# Altium schematic sheet 00 - Main.SchDoc
size A4; SheetNumber: 1; SheetTotal: 3
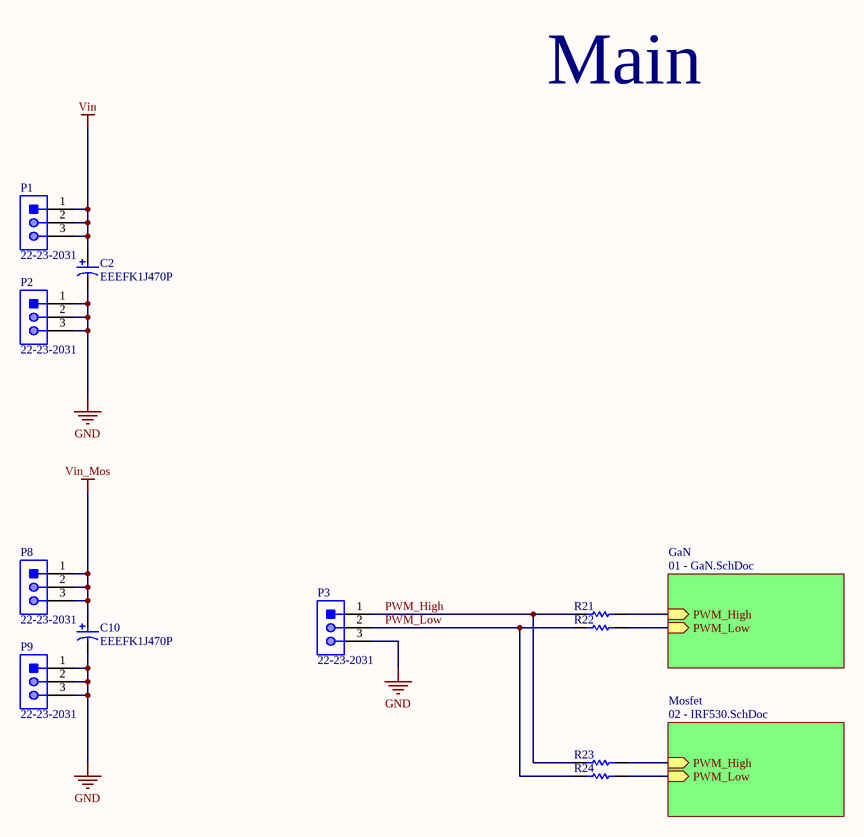
[diagram p0: 00 - Main.SchDoc]

## Parts
C2  EEEFK1J470P  [PNSC-FK-V-F_V]
C10  EEEFK1J470P  [PNSC-FK-V-F_V]
P1  22-23-2031  [MOLX-22-23-2031_V]
P2  22-23-2031  [MOLX-22-23-2031_V]
P3  22-23-2031  [MOLX-22-23-2031_V]
P8  22-23-2031  [MOLX-22-23-2031_V]
P9  22-23-2031  [MOLX-22-23-2031_V]
R21  CRCW02010000Z0ED  [RESC0603X28X15NL5T05]  (value not drawn)
R22  CRCW02010000Z0ED  [RESC0603X28X15NL5T05]  (value not drawn)
R23  CRCW02010000Z0ED  [RESC0603X28X15NL5T05]  (value not drawn)
R24  CRCW02010000Z0ED  [RESC0603X28X15NL5T05]  (value not drawn)

## Sub-sheets
GaN = 01 - GaN.SchDoc: PWM_High (in), PWM_Low (in)
Mosfet = 02 - IRF530.SchDoc: PWM_High (in), PWM_Low (in)

## Nets
GND: C2.2 C10.2 P2.1 P2.2 P2.3 P3.3 P9.1 P9.2 P9.3
Vin: C2.1 P1.1 P1.2 P1.3
Vin_Mos: C10.1 P8.1 P8.2 P8.3
PWM_High: P3.1 R21.2 R23.2
PWM_Low: P3.2 R22.2 R24.2
NetR21_1: R21.1 ; sheet GaN/PWM_High
NetR22_1: R22.1 ; sheet GaN/PWM_Low
NetR23_1: R23.1 ; sheet Mosfet/PWM_High
NetR24_1: R24.1 ; sheet Mosfet/PWM_Low

## Notes on the sheet
- Main

## Library data of the parts
C2 C10 = CMP-2000-06210-1: Aluminum Electrolytic Capacitor, 47 uF, +/- 20%, 63 V, 2-Pin SMD (Size Code F), -55 to 105 degC, RoHS, Tape and Reel; Manufacturer: Panasonic; External Length / Height: 10.2mm; Power Factor: 0.08; AE Capacitor Case: RadialCan-SMD; Operating Lifetime: 2000h; Voltage Rating: 63V; SVHC: NoSVHC(16-Dec-2013); Life Time @ Temperature: 2000hours@105°C; Ripple Current AC: 250mA; Ripple Current Frequency: 100kHz; Power Factor Frequency: 120Hz; Capacitance: 47µF; Impedance: 0.65ohm; Product Range: PANASONIC-FKSeries; Ripple Current Temperature: 105°C; Package Description: 2-Pin Electrolytic Aluminum Capacitor, Body 8.3 x 8.3 mm; Package Reference: FK-V-F; Mounting Technology: SurfaceMount; Operating Temperature Min: -55°C; Capacitor Case Style: SMD; Datasheet URL: http://industrial.panasonic.com/cdbs/www-data/pdf/RDE0000/ABA0000C1181.pdf; Package / Case: F; Capacitance Tolerance ±: ±20%; Packaging: CutTape; Operating Temperature Max: 105°C; Voltage Rating V DC: 63V; Datasheet Version: 03/2016; Tolerance +: 20%; Diameter: 8mm; Tolerance -: 20%; Capacitor Terminals: SMD; Manufacturer URL: http://www.panasonic.com/; Operating life Time: 2000h; Lifetime @ Temperature: 2000hours@105°C; Package URL: http://industrial.panasonic.com/cdbs/www-data/pdf/RDE0000/DME0000COL48.pdf; Height: 10.2mm; Operating Temperature Range: -55°Cto+105°C; Series: FK; Capacitance Tolerance: ±20%
P1-P3 P8 P9 = CMP-2000-05242-1: Male Header, Pitch 2.54 mm, 1 x 3 Position, Height 8.18 mm, Tail Length 3.56 mm, RoHS, Bulk; Current Rating: 4A; Brand: Molex; Pitch: 2.54mm; Voltage Rating: 250V; Mounting Angle: Vertical; Type: Locking; Factory Pack Quantity: 16000; Tradename: KK; Housing Material: Nylon; Contact Material: Brass; Manufacturer URL: http://www.molex.com/; Termination Style: ThroughHole; Mounting Style: ThroughHole; Number of Positions: 3Position; Contact Gender: Pin(Male); Packaging: Bulk; Series: 6373; Datasheet Version: Sep-01; Contact Plating: Tin; Product: Headers; Datasheet URL: https://datasheet.ciiva.com/19472/232274-19472863.pdf; RoHS: Details; Product Category: Headers&WireHousings; Manufacturer: Molex; Number of Rows: 1Row
R21-R24 = CMP-2004-00001-2: Chip Resistor, 0 Ohm, Jumper, 0.05 W, -55 to 155 degC, 0201 (0603 Metric), RoHS, Tape and Reel; Voltage Rating: 30 V; Case\Package: 0201; Resistance: 0 mohm; Tolerance: 5%; Power Rating: 50 mW; REACH SVHC: Unknown; Length: 0.6 mm; Packaging: Cut Tape; Weight: 6E-06 oz; ComponentLink2URL: http://www.vishay.com/docs/20052/crcw0201e3.pdf; Mounting Technology: Surface Mount; Case Code (Imperial): 0201; Radiation Hardening: No; RoHSCompliant: true; Package Quantity: 1; Min Operating Temperature: -55 degC; Height: 0.23 mm; PackageReference: 0201; ComponentLink1Description: Manufacturer URL; ComponentLink2Description: Datasheet; Case Code (Metric): 0603; DatasheetVersion: 03/2016; Width: 0.3 mm; Mount: Surface Mount; PackageDescription: 2-Pin Surface Mount Device, Body 0.6 x 0.3 mm; ComponentLink1URL: http://www.vishay.com/; Max Operating Temperature: 155 degC